# Altium schematic sheet buckReg.SchDoc
size A3
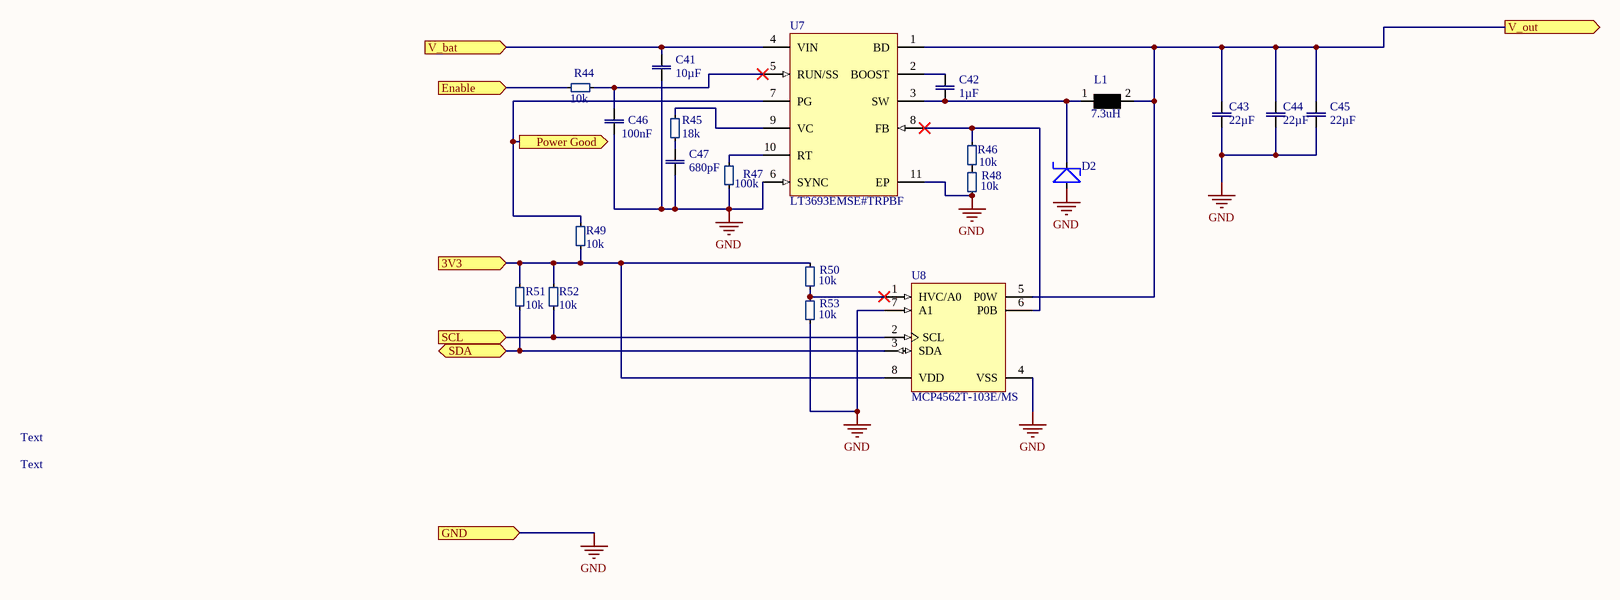
[diagram p0: buckReg.SchDoc]

## Parts
C41  Capacitance: 10µF  [Chip2PinSM127P600-8N]  (hidden comment: CL31A106MBHNNNE)
C42  Capacitance: 1µF  [CAP0805]  (hidden comment: CL21B105KBFNNNG)
C43  Capacitance: 22µF  [FP-CL31H-0_2-IPC_C]  (hidden comment: CL31A226KAHNNNE)
C44  Capacitance: 22µF  [FP-CL31H-0_2-IPC_C]  (hidden comment: CL31A226KAHNNNE)
C45  Capacitance: 22µF  [FP-CL31H-0_2-IPC_C]  (hidden comment: CL31A226KAHNNNE)
C46  Capacitance: 100nF  [cap0402]  (hidden comment: GRM155R71H104ME14D)
C47  Capacitance: 680pF  [cap0402]  (hidden comment: CC0402JRX7R9BB681)
D2  MBR12100LPS-TP  [DFN445P552X120-3N]  (value not drawn)
L1  Inductance: 7.3uH  [INDP130128X65N]  (hidden comment: 7443551730)
R44  Resistance: 10k  [SMD_0402(1005)_M]  (hidden comment: RC0402FR-0710KL)
R45  value 18k  [RESC1005X40X25NL05T10]  (hidden comment: RC0402FR0718K)
R46  Resistance: 10k  [SMD_0402(1005)_M]  (hidden comment: RC0402FR-0710KL)
R47  Resistance: 100k  [SMD_0402(1005)_M]  (hidden comment: RC0402FR-07100KL)
R48  Resistance: 10k  [SMD_0402(1005)_M]  (hidden comment: RC0402FR-0710KL)
R49  Resistance: 10k  [SMD_0402(1005)_M]  (hidden comment: RC0402FR-0710KL)
R50  Resistance: 10k  [SMD_0402(1005)_M]  (hidden comment: RC0402FR-0710KL)
R51  Resistance: 10k  [SMD_0402(1005)_M]  (hidden comment: RC0402FR-0710KL)
R52  Resistance: 10k  [SMD_0402(1005)_M]  (hidden comment: RC0402FR-0710KL)
R53  Resistance: 10k  [SMD_0402(1005)_M]  (hidden comment: RC0402FR-0710KL)
U7  LT3693EMSE#TRPBF  [LT-MSE-10-EDP-2060x1830TP_M]
U8  MCP4562T-103E/MS  [MSOP-MS8_N]

## Ports
3V3 (in), Enable (in), GND (in), Power Good (out), SCL (in), SDA (bidir), V_bat (in), V_out (out)

## Nets
GND: C41.1 C43.1 C44.1 C45.1 C46.1 C47.1 D2.2(A) R47.1 R48.1 R53.1 U7.6(SYNC) U7.11(EP) U8.4(VSS) U8.7(A1) ; port GND
3V3: R49.1 R50.2 R51.2 R52.2 U8.8(VDD) ; port 3V3
Enable: R44.2 ; port Enable
Power Good: R49.2 U7.7(PG) ; port Power Good
SCL: R52.1 U8.2(SCL) ; port SCL
SDA: R51.1 U8.3(SDA) ; port SDA
V_bat: C41.2 U7.4(VIN) ; port V_bat
V_out: C43.2 C44.2 C45.2 L1.2 U7.1(BD) U8.5(P0W) ; port V_out
NetC42_1: C42.1 D2.1(K) L1.1 U7.3(SW)
NetC42_2: C42.2 U7.2(BOOST)
NetC46_2: C46.2 R44.1 U7.5(RUN/SS)
NetC47_2: C47.2 R45.1
NetR45_2: R45.2 U7.9(VC)
NetR46_1: R46.1 R48.2
NetR46_2: R46.2 U7.8(FB) U8.6(P0B)
NetR47_2: R47.2 U7.10(RT)
NetR50_1: R50.1 R53.2 U8.1(HVC/A0)

## Notes on the sheet
- Text

## Library data of the parts
C41 = CMP-0001-00015-3: CAP CER 10UF 50V X5R 1206; Tolerance: 20%; Capacitor Type: Ceramic; Packaging: Tape and Reel; Case Code (Metric): 3216; Voltage Rating: 50V; Voltage Rating (DC): 50V; RoHS: Yes; Case Code (Imperial): 1206; Thickness: 0.071inch; Min Operating Temperature: -55°C; Dielectric: X5R; Width: 0.063inch; Max Operating Temperature: 85°C; Case/Package: 1206; Mount: Surface Mount; Length: 0.126inch
C42 = CMP-0001-00012-4: SAMSUNG ELECTRO-MECHANICS - CL21B105KBFNNNG - MLCC CAPACITORS; Voltage Rating: 50V; Dielectric: X7R; Material: Ceramic; Tolerance: 10%; RoHS: Yes; Termination: Wraparound; Case Code (Imperial): 0805; Min Operating Temperature: -55°C; Package Quantity: 3000; Packaging: Tape and Reel; Length: 2mm; Width: 0.049inch; Thickness: 0.053inch; Mount: Surface Mount; Contact Plating: Tin; Voltage: 50V; Max Operating Temperature: 125°C; Case Code (Metric): 2012; Depth: 1.25mm; Case/Package: 0805; Capacitor Type: Ceramic
C43-C45 = CMP-0001-00023-2: SAMSUNG ELECTRO-MECHANICS - CL31A226KAHNNNE - Keramikvielschichtkondensator, SMD, 22 µF, 25 V, 1206 [Metrisch 3216], ± 10%, X5R, CL Series; Voltage Rating: 25V; Capacitor Type: Ceramic; Tolerance: 10%; RoHS: Yes; Mount: Surface Mount; Case/Package: 1206
C46 = CMP-0001-00001-9: 0402 0.1 uF 50 V ±20% Tolerance X7R SMT Monolithic Ceramic Chip Capacitor; Value: 100nF; Voltage Rating: 50V; Length: 0.039inch; Packaging: Cut Tape; Max Operating Temperature: 125°C; Min Operating Temperature: -55°C; Mount: Surface Mount; Case/Package: 0402; Tolerance: 20%; Width: 0.02inch; Capacitor Type: Ceramic; Thickness: 0.022inch; Pins: 2; RoHS: Yes
C47 = CMP-002-0000-2: Multilayer Ceramic Capacitors MLCC - SMD/SMT 22K pF 10% 50 Volts; Voltage Rating: 50V; Dielectric: X7R; Packaging: Tape and Reel; Case Code (Metric): 1005; Halogen Free: Halogen Free; Max Operating Temperature: 125°C; Thickness: 0.022inch; Mount: Surface Mount; Weight: 2.3E-05oz; RoHS: Yes; Package Quantity: 10000; Case Code (Imperial): 0402; Case/Package: 0402; Length: 0.039inch; Depth: 0.5mm; Lead Free: Lead Free; Voltage Rating (DC): 50V; Termination: SMD/SMT; Min Operating Temperature: -55°C; Composition: Ceramic; Capacitor Type: Ceramic; Tolerance: 10%; Width: 0.02inch
D2 = CMP-ROOT-00021-2: Diode Schottky 100V 12A TO277B; Max Reverse Voltage (DC): 100V; Case/Package: TO-277, 3-PowerDFN; Average Rectified Current: 12A; Mount: Surface Mount; RoHS: Yes; Packaging: Tape and Reel
L1 = CMP-ROOT-00003-1: WURTH ELEKTRONIK         7443551730             Surface Mount Power Inductor, WE-HCI Series, 7.3 H, 13 A, 12 A, Shielded, 5900 ohm; Tolerance: 20%; Max DC Current: 13A; DC Resistance (DCR): 5.9mR; Saturation Current: 12A; Series Resistance: 5.9R; Test Frequency: 100kHz; Self Resonant Frequency: 28MHz; Case/Package: 1365; Packaging: Tape and Reel; Shielding: Shielded; Width: 12.8mm; Package Quantity: 400; Composition: Wirewound; Lead Free: Lead Free; Min Operating Temperature: -40°C; Mount: Surface Mount; Current Rating: 13A; RMS Current (Irms): 13A; Termination: SMD/SMT; REACH SVHC: Unknown; RoHS: Yes; Inductance Tolerance: 20%; Number of Pins: 2; Depth: 12.8mm; Height: 6.2mm; Max Operating Temperature: 155°C; Height - Seated (Max): 0.256inch; Length: 13.2mm
R44 R49 R51 R52 = CMP-008-0005-10: Surface Mount Thick Film Resistor, Rc Series, 10 Kohm, 62.5 Mw, - 1%, 50 V, 0402 [1005 Metric]; Voltage Rating: 50V; Temperature Coefficient: 100ppm/°C; Power Rating: 62.5mW; Value: 10k; Case/Package: 0402; Lead Free: Lead Free; Case Code (Imperial): 0402; Termination: SMD/SMT; Max Operating Temperature: 155°C; Height: 0.32mm; Length: 1mm; Min Operating Temperature: -55°C; Case Code (Metric): 1005; Depth: 0.5mm; Mount: SMD; REACH SVHC: No SVHC; Military Standard: Not; Tolerance: 1%; Number of Pins: 2; Voltage Rating (DC): 50V; Composition: Thick Film; RoHS: Yes; Packaging: Tape and Reel; Width: 0.5mm; Lead Pitch: 0.2mm; Working Voltage: 50V; Number of Terminations: 2
R45 = CMP-001-0023-4: RES SMD 18K OHM 1% 1/16W 0402; Power Rating: 62.5mW; Voltage Rating: 50V; Temperature Coefficient: 100ppm/°C; REACH SVHC: Unknown; Lead Free: Lead Free; Depth: 0.5mm; Composition: Thick Film; Mount: SMD; Tolerance: 1%; Case Code (Metric): 1005; Min Operating Temperature: -55°C; Packaging: Tape and Reel; Case/Package: 0402; Military Standard: Not; Weight: 2.3E-05oz; Termination: SMD/SMT; RoHS: Yes; Width: 0.02inch; Max Operating Temperature: 155°C; Height: 0.016inch; Length: 1mm; Resistance: 18k
R46 R48 R50 R53 = CMP-008-0005-10: Surface Mount Thick Film Resistor, Rc Series, 10 Kohm, 62.5 Mw, - 1%, 50 V, 0402 [1005 Metric]; Voltage Rating: 50V; Power Rating: 62.5mW; Value: 10k; Temperature Coefficient: 100ppm/°C; Case/Package: 0402; Lead Pitch: 0.2mm; Tolerance: 1%; Composition: Thick Film; Voltage Rating (DC): 50V; Case Code (Metric): 1005; Width: 0.5mm; Lead Free: Lead Free; Number of Terminations: 2; Number of Pins: 2; Mount: SMD; Termination: SMD/SMT; Military Standard: Not; REACH SVHC: No SVHC; Length: 1mm; Depth: 0.5mm; Working Voltage: 50V; Packaging: Tape and Reel; Case Code (Imperial): 0402; Max Operating Temperature: 155°C; Height: 0.32mm; RoHS: Yes; Min Operating Temperature: -55°C
R47 = CMP-0001-00006-5: Res General Purpose Thick Film 0402 100K Ohm 1% 1/16W ±100ppm/°C Molded SMD Paper T/R; Max Power Dissipation: 63mW; Voltage Rating: 50V; Value: 100k; Termination: SMD/SMT; Tolerance: 1%; Length: 0.039inch; REACH SVHC: No SVHC; Features: Moisture Resistant; Mount: SMD; Power Rating: 63mW; Depth: 0.5mm; Max Operating Temperature: 155°C; Width: 0.02inch; Height: 0.016inch; Case Code (Metric): 1005; Temperature Coefficient: 100ppm/°C; Military Standard: Not; Case/Package: 0402; Lead Free: Lead Free; Working Voltage: 50V; Package Quantity: 1; Number of Terminations: 2; Min Operating Temperature: -55°C; Composition: Thick Film; RoHS: Yes; Packaging: Tape and Reel; Case Code (Imperial): 0402
U7 = CMP-00010-6: 36V, 3.5A, 2.4MHz Step-Down Switching Reg in MSOP-E; Synchronous Rectifier: No; Min Input Voltage: 3.6V; Output Voltage: 30V; Number of Outputs: 1; Switching Frequency: 2.45MHz; Output Configuration: Positive; Min Output Voltage: 790mV; Output Type: Adjustable; RoHS Compliant: Yes; Max Output Voltage: 30V; Packaging: Tape and Reel; Number of Pins: 10; Case/Package: SOP; Max Input Voltage: 36V; Series: -; Min Operating Temperature: -40°C; Output Current: 3.5A; Max Operating Temperature: 125°C; Package Quantity: 1
U8 = CMP-006-0005-2: Digital Potentiometer; Single 8-bit; -40C to +125C Temp; MSOP-8; T&R packing